# Altium schematic sheet [3]-PowerIN_Page.SchDoc
size A4
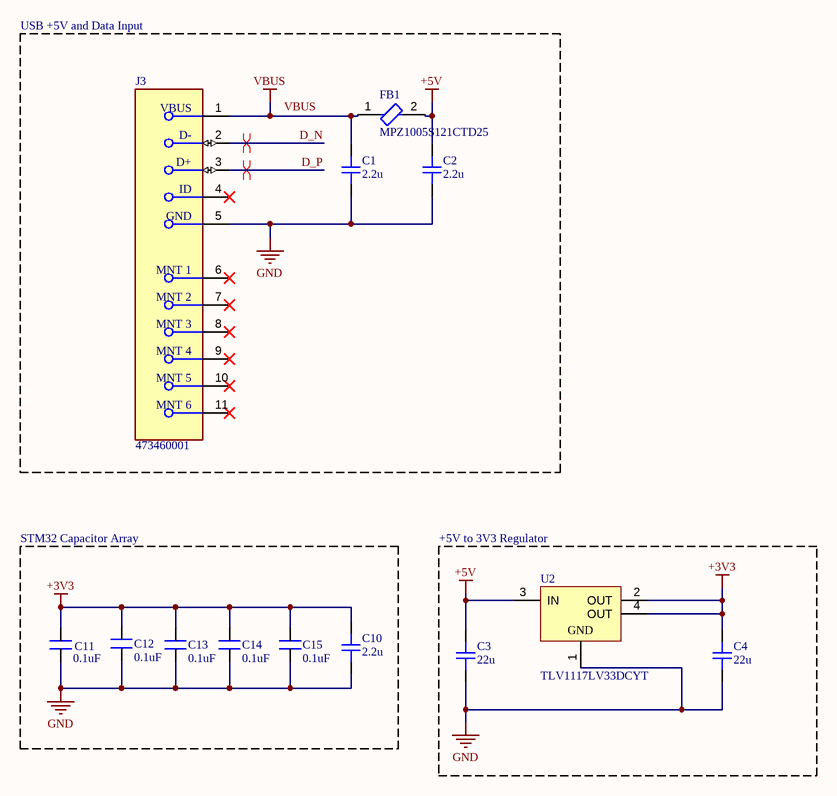
[diagram p0: [3]-PowerIN_Page.SchDoc]

## Parts
C1  2.2u  [CAP_0603]
C2  2.2u  [CAP_0603]
C3  22u  [CAP_0805]
C4  22u  [CAP_0805]
C10  2.2u  [CAP_0603]
C11  0.1uF  [CAP_0805]
C12  0.1uF  [CAP_0805]
C13  0.1uF  [CAP_0805]
C14  0.1uF  [CAP_0805]
C15  0.1uF  [CAP_0805]
FB1  MPZ1005S121CTD25  [FP-MPZ1005-IPC_C]
J3  473460001  [FP-473460001-MFG]
U2  TLV1117LV33DCYT  [DCY0004A_M]

## Blocks framed on the sheet
USB +5V and Data Input: C1 C2 FB1 J3
STM32 Capacitor Array: C10-C15
+5V to 3V3 Regulator: C3 C4 U2

## Nets
+3V3: C4.2 C10.2 C11.2 C12.2 C13.2 C14.2 C15.2 U2.2(OUT) U2.4(OUT)
+5V: C2.2 C3.2 FB1.2 U2.3(IN)
GND: C1.1 C2.1 C3.1 C4.1 C10.1 C11.1 C12.1 C13.1 C14.1 C15.1 J3.5(GND) U2.1(GND)
VBUS: C1.2 FB1.1 J3.1(VBUS)
D_N: J3.2(D-)
D_P: J3.3(D+)

Not connected (* = marked no-connect by the designer): J3 4(ID)* 6(MNT_1)* 7(MNT_2)* 8(MNT_3)* 9(MNT_4)* 10(MNT_5)* 11(MNT_6)*

## Layout directives
differential pair; differential pair class DIFF_USB: D_N, D_P

## Notes on the sheet
- Labels drawn without touching a wire or pin: VBUS
- DWG. NO.
- REV.
- SHT.
- THIS DOCUMENT AND THE DATA DISCLOSED HEREIN OR HEREWITH IS THE PROPERTY OF ALTIUM LIMITED AND MAY BE FREELY DISTRIBUTED IN WHOLE. NO RIGHTS ARE RESERVED OR EXPRESS OR IMPLIED WARANTEE GIVEN.
- REVISION
- DESCRIPTION
- DATE
- APPROVED
- ENG:
- APPROVALS
- PROJECT
- DSN:
- CHK:
- REFERENCE DOCUMENTS
- PROJECT REVISION:
- TITLE
- DOCUMENT REVISION:
- DESIGN ITEM:
- BOM:
- FAB DWG:
- PCB DWG:
- ASSY DWG:
- SCALE:
- SIZE
- B
- CAGE CODE
- FILE NAME
- DWG NO.
- SHEET
- OF
- REV

## Library data of the parts
C1 C2 C10 = CAP_0603: Capacitor SMD 0603; Manufacturer: *; Manufacturer Part Number: *; Distributor Link: *; LCSC: *; Rating: *; Dielectric: *
C3 C4 = CAP_0805: Capacitor SMD 0805; Manufacturer: *; Manufacturer Part Number: *; Distributor Link: *; LCSC: *; Rating: *; Dielectric: *
C11-C15 = CAP_0.1uF-50V-5%-0805: 0.1µF ±5% 50V Ceramic Capacitor X7R 0805 (2012 Metric); Manufacturer: KEMET; Manufacturing Part Number: C0805C104J5RACTU; Case/Package: 0805 (2012 Metric); Supplier-1: Digikey; Supplier Part Number-1: 399-1171-1-ND
FB1 = CMP-08257-000074-1: Power line Ferrite Bead 120Ω @ 100MHz 1.2A DCR 0.09Ω AEC-Q200 SMD 0402; Number of Lines: 1; Tolerance: 25%; DC Resistance (DCR): 90mR; Impedance: 120R; Width: 0.02inch; Weight: 2.3E-05oz; Max DC Current: 1.2A; Test Frequency: 100MHz; Packaging: Tape and Reel; Ratings: AEC-Q200; Package Quantity: 10000; Length: 0.039inch; Max Current Rating: 1.2A; Case Code (Metric): 1005; Mount: Surface Mount; Termination: SMD/SMT; Max Operating Temperature: 125°C; Height: 0.022inch; Min Operating Temperature: -55°C; Case Code (Imperial): 0402; Lead Free: Lead Free; Case/Package: 0402; RoHS Compliant: Yes
J3 = CMP-2000-05246-2: CONN RCPT USB2.0 MICRO B SMD R/A; Manufacturer: Molex; Conn Orientation: Right Angle; Is Female: yes; Shielding: true; Pitch: 0.65mm; Number Of Contacts: 5; Voltage Rating: 30V; Current Rating: 1.8A; Device Class L2: USB Connectors; Digikey Description: CONN RCPT USB2.0 MICRO B SMD R/A; Height: 2.945mm; RoHS: TRUE; ComponentLink2Description: Datasheet; Octopart: https://octopart.com/47346-0001-molex-7164928; Automotive: No; Package: 0; Category: Conn; Device Class L1: Connectors; Usb Standard: USB 2.0; Temperature: -30°C to +85°C; Temperature Range Low: -30°C; Footprint Url: https://www.molex.com/pdm_docs/sd/473460001_sd.pdf; ComponentLink2URL: https://www.molex.com/webdocs/datasheets/pdf/en-us/0473460001_IO_CONNECTORS.pdf; Lead Free: Yes; Manufacturer Part Number: 473460001; Contact Material: Gold,Nickel; Temperature Range High: +85°C; Device Class L3: unset
U2 = CMP-0395-00499-2: Single Output LDO, 1 A, Fixed 3.3 V Output, 2 to 5.5 V Input, 4-pin SOT-223 (DCY), -40 to 125 degC, Green (RoHS & no Sb/Br); Manufacturer: Texas Instruments; Vout Adj(Max)(V): 3.3; Iout(Max)(A): 1; SubFamily: Single Channel LDO; Iq(Typ)(mA): 0.05; Accuracy(%): 2; Vin(Max)(V): 5.5; Vdo(Typ)(mV): 1200; PartNumber: TLV1117LV33DCYT; PackageReference: DCY0004A; PackageVersion: 4202506/B; ComponentLink1URL: http://www.ti.com/; DatasheetVersion: SBVS160A; Mounting Technology: Surface Mount; Fixed Output Options(V): 3.3; ComponentLink3Description: Package Specification; PackageDescription: 4-Pin Plastic Small Outline, Body 3.5 x 6.5 mm, Pitch 2.3 mm; Vout Adj(Min)(V): 3.3; ComponentLink2URL: http://www.ti.com/general/docs/lit/getliterature.tsp?genericPartNumber=TLV1117LV33&fileType=pdf; Code_JEDEC: TO-261; ComponentLink1Description: Manufacturer URL; Vin(Min)(V): 2; ComponentLink2Description: Datasheet; Eco-Plan: Green (RoHS & no Sb/Br); ComponentLink3URL: http://www.ti.com/litv/pdf/mpds094a